# EAGLE design tick-ref-gps-disp (EAGLE 6.2)
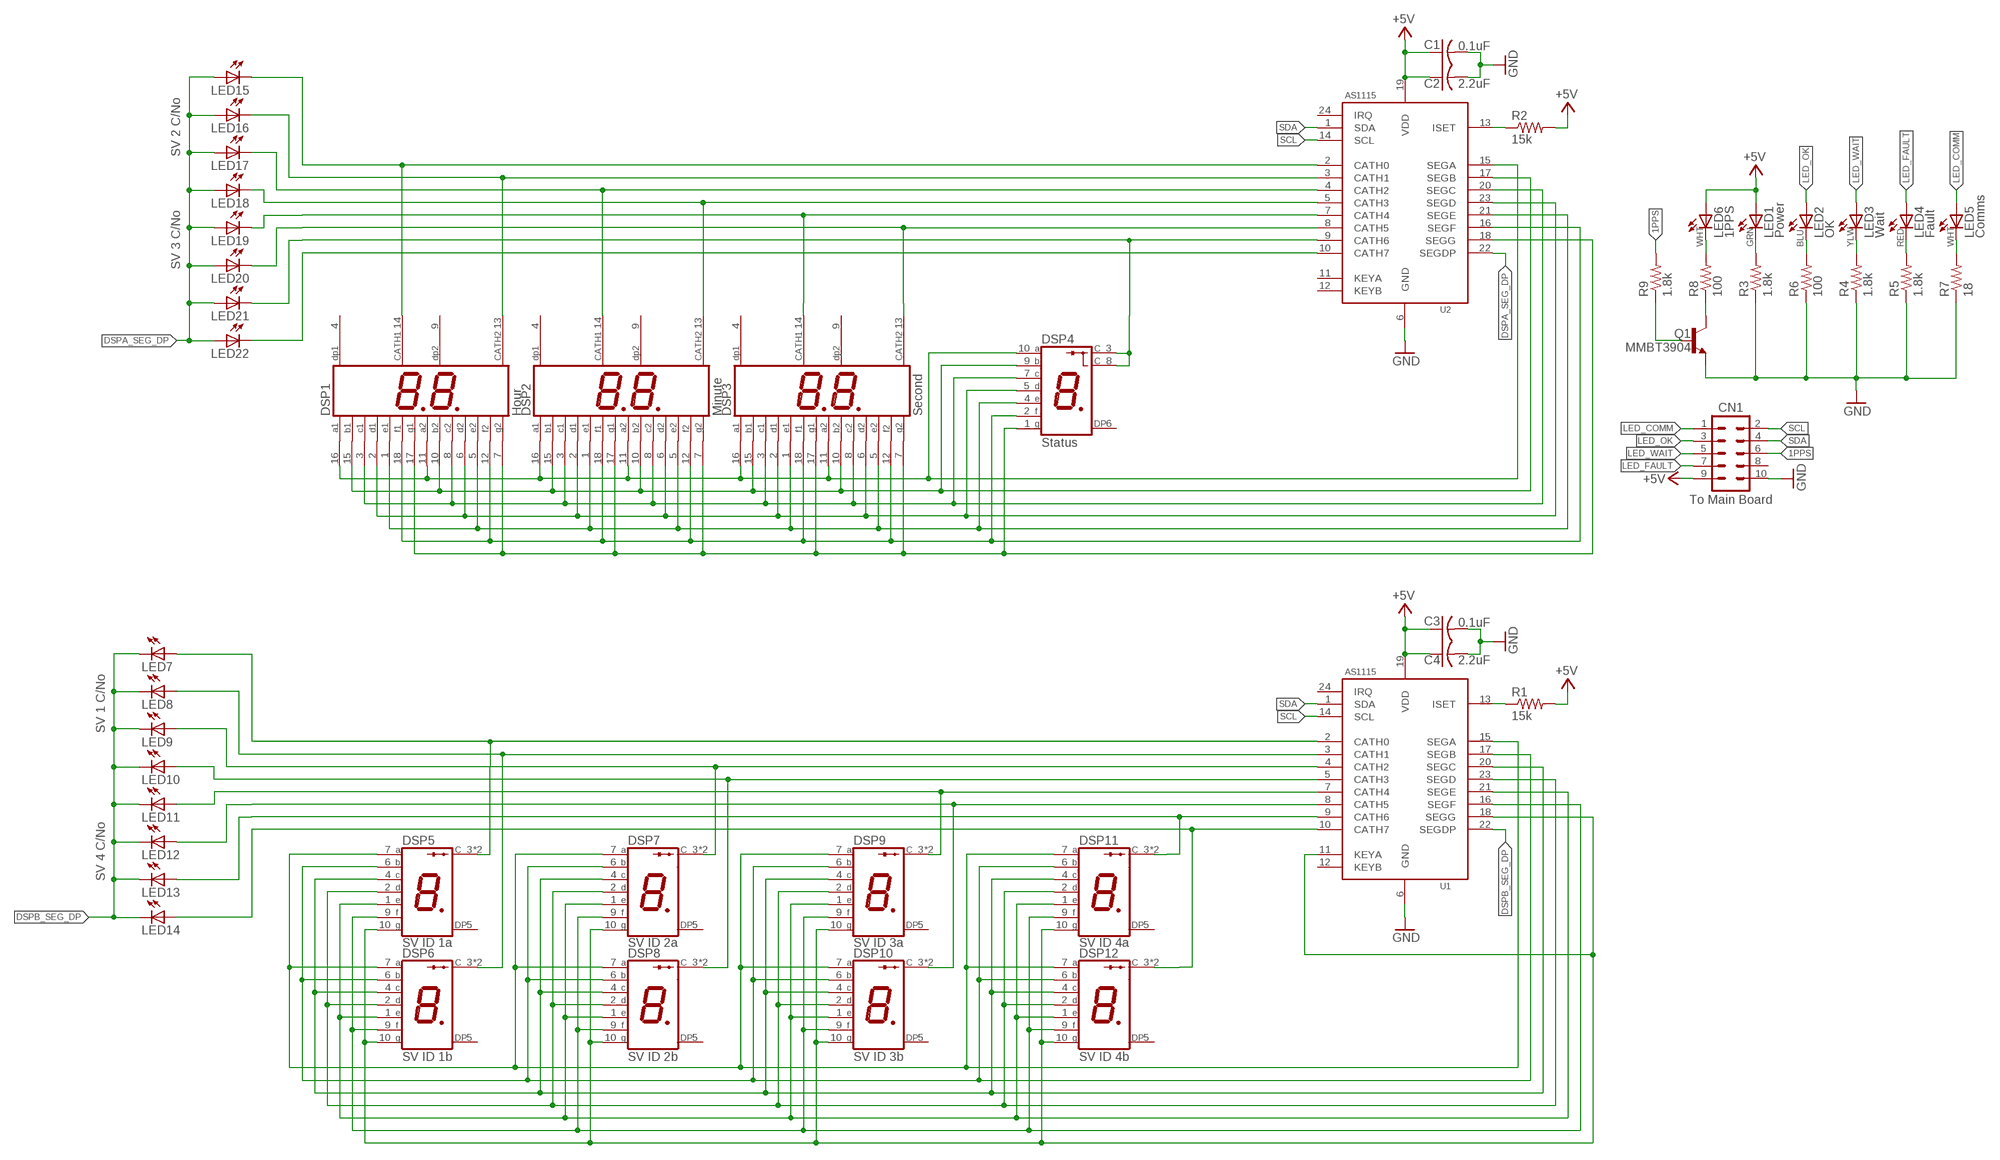
[diagram p0: schematic, sheet 1]

## Parts
C1  0.1uF  C-USC0603  [C0603]
C2  2.2uF  C-USC0805  [C0805]
C3  0.1uF  C-USC0603  [C0603]
C4  2.2uF  C-USC0805  [C0805]
CN1  To Main Board  M05X2PTH  [AVR_ICSP]
DSP1  Hour  LUMEX-LDD-C81XRI  [LUMEX-LDD-C81XRI]
DSP2  Minute  LUMEX-LDD-C81XRI  [LUMEX-LDD-C81XRI]
DSP3  Second  LUMEX-LDD-C81XRI  [LUMEX-LDD-C81XRI]
DSP4  Status  S4301B  [S4301B]
DSP5  SV ID 1a  KINGBRIGHT-ACSC02  [KINGBRIGHT-ACSA02]
DSP6  SV ID 1b  KINGBRIGHT-ACSC02  [KINGBRIGHT-ACSA02]
DSP7  SV ID 2a  KINGBRIGHT-ACSC02  [KINGBRIGHT-ACSA02]
DSP8  SV ID 2b  KINGBRIGHT-ACSC02  [KINGBRIGHT-ACSA02]
DSP9  SV ID 3a  KINGBRIGHT-ACSC02  [KINGBRIGHT-ACSA02]
DSP10  SV ID 3b  KINGBRIGHT-ACSC02  [KINGBRIGHT-ACSA02]
DSP11  SV ID 4a  KINGBRIGHT-ACSC02  [KINGBRIGHT-ACSA02]
DSP12  SV ID 4b  KINGBRIGHT-ACSC02  [KINGBRIGHT-ACSA02]
LED1  Power  LED5MM  [LED5MM]
LED2  OK  LED5MM  [LED5MM]
LED3  Wait  LED5MM  [LED5MM]
LED4  Fault  LED5MM  [LED5MM]
LED5  Comms  LED5MM  [LED5MM]
LED6  1PPS  LED5MM  [LED5MM]
LED7  LEDCHIP-LED0805  [CHIP-LED0805]
LED8  LEDCHIP-LED0805  [CHIP-LED0805]
LED9  LEDCHIP-LED0805  [CHIP-LED0805]
LED10  LEDCHIP-LED0805  [CHIP-LED0805]
LED11  LEDCHIP-LED0805  [CHIP-LED0805]
LED12  LEDCHIP-LED0805  [CHIP-LED0805]
LED13  LEDCHIP-LED0805  [CHIP-LED0805]
LED14  LEDCHIP-LED0805  [CHIP-LED0805]
LED15  LEDCHIP-LED0805  [CHIP-LED0805]
LED16  LEDCHIP-LED0805  [CHIP-LED0805]
LED17  LEDCHIP-LED0805  [CHIP-LED0805]
LED18  LEDCHIP-LED0805  [CHIP-LED0805]
LED19  LEDCHIP-LED0805  [CHIP-LED0805]
LED20  LEDCHIP-LED0805  [CHIP-LED0805]
LED21  LEDCHIP-LED0805  [CHIP-LED0805]
LED22  LEDCHIP-LED0805  [CHIP-LED0805]
Q1  MMBT3904  TRANSISTOR_NPNSOT23  [SOT23]
R1  15k  R-US_R0603  [R0603]
R2  15k  R-US_R0603  [R0603]
R3  1.8k  R-US_R0603  [R0603]
R4  1.8k  R-US_R0603  [R0603]
R5  1.8k  R-US_R0603  [R0603]
R6  100  R-US_R0603  [R0603]
R7  18  R-US_R0603  [R0603]
R8  100  R-US_R0603  [R0603]
R9  1.8k  R-US_R0603  [R0603]
U1  AS1115  [QSOP24]
U2  AS1115  [QSOP24]

## Nets
1PPS: CN1.6 R9.2
1PPS_Q: Q1.1(B) R9.1
1PPS_R_Q: Q1.3(C) R8.1
+5V: C1.1 C2.1 C3.1 C4.1 CN1.9 LED1.A LED6.A R1.2 R2.2 U1.19(VDD) U2.19(VDD)
CATH_HOUR_LS: DSP1.13(CATH2) LED16.C U2.3(CATH1)
CATH_HOUR_MS: DSP1.14(CATH1) LED15.C U2.2(CATH0)
CATH_MIN_LS: DSP2.13(CATH2) LED18.C U2.5(CATH3)
CATH_MIN_MS: DSP2.14(CATH1) LED17.C U2.4(CATH2)
CATH_SEC_LS: DSP3.13(CATH2) LED20.C U2.8(CATH5)
CATH_SEC_MS: DSP3.14(CATH1) LED19.C U2.7(CATH4)
CATH_STATUS_MS: DSP4.3(C) DSP4.8(C) LED21.C U2.9(CATH6)
CATH_STRENGTH: LED22.C U2.10(CATH7)
DSP5-C: DSP5.3(CATH) DSP5.8(CATH) LED7.A U1.2(CATH0)
DSP6-C: DSP6.3(CATH) DSP6.8(CATH) LED8.A U1.3(CATH1)
DSP7-C: DSP7.3(CATH) DSP7.8(CATH) LED9.A U1.4(CATH2)
DSP8-C: DSP8.3(CATH) DSP8.8(CATH) LED10.A U1.5(CATH3)
DSP9-C: DSP9.3(CATH) DSP9.8(CATH) LED11.A U1.7(CATH4)
DSP10-C: DSP10.3(CATH) DSP10.8(CATH) LED12.A U1.8(CATH5)
DSP11-C: DSP11.3(CATH) DSP11.8(CATH) LED13.A U1.9(CATH6)
DSP12-C: DSP12.3(CATH) DSP12.8(CATH) LED14.A U1.10(CATH7)
DSPA_SEG_A: DSP1.11(A2) DSP1.16(A1) DSP2.11(A2) DSP2.16(A1) DSP3.11(A2) DSP3.16(A1) DSP4.10(A) U2.15(SEGA)
DSPA_SEG_B: DSP1.10(B2) DSP1.15(B1) DSP2.10(B2) DSP2.15(B1) DSP3.10(B2) DSP3.15(B1) DSP4.9(B) U2.17(SEGB)
DSPA_SEG_C: DSP1.3(C1) DSP1.8(C2) DSP2.3(C1) DSP2.8(C2) DSP3.3(C1) DSP3.8(C2) DSP4.7(C) U2.20(SEGC)
DSPA_SEG_D: DSP1.2(D1) DSP1.6(D2) DSP2.2(D1) DSP2.6(D2) DSP3.2(D1) DSP3.6(D2) DSP4.5(D) U2.23(SEGD)
DSPA_SEG_DP: LED15.A LED16.A LED17.A LED18.A LED19.A LED20.A LED21.A LED22.A U2.22(SEGDP)
DSPA_SEG_E: DSP1.1(E1) DSP1.5(E2) DSP2.1(E1) DSP2.5(E2) DSP3.1(E1) DSP3.5(E2) DSP4.4(E) U2.21(SEGE)
DSPA_SEG_F: DSP1.12(F2) DSP1.18(F1) DSP2.12(F2) DSP2.18(F1) DSP3.12(F2) DSP3.18(F1) DSP4.2(F) U2.16(SEGF)
DSPA_SEG_G: DSP1.7(G2) DSP1.17(G1) DSP2.7(G2) DSP2.17(G1) DSP3.7(G2) DSP3.17(G1) DSP4.1(G) U2.18(SEGG)
DSPB_SEG_A: DSP5.7(A) DSP6.7(A) DSP7.7(A) DSP8.7(A) DSP9.7(A) DSP10.7(A) DSP11.7(A) DSP12.7(A) U1.15(SEGA)
DSPB_SEG_B: DSP5.6(B) DSP6.6(B) DSP7.6(B) DSP8.6(B) DSP9.6(B) DSP10.6(B) DSP11.6(B) DSP12.6(B) U1.17(SEGB)
DSPB_SEG_C: DSP5.4(C) DSP6.4(C) DSP7.4(C) DSP8.4(C) DSP9.4(C) DSP10.4(C) DSP11.4(C) DSP12.4(C) U1.20(SEGC)
DSPB_SEG_D: DSP5.2(D) DSP6.2(D) DSP7.2(D) DSP8.2(D) DSP9.2(D) DSP10.2(D) DSP11.2(D) DSP12.2(D) U1.23(SEGD)
DSPB_SEG_DP: LED7.C LED8.C LED9.C LED10.C LED11.C LED12.C LED13.C LED14.C U1.22(SEGDP)
DSPB_SEG_E: DSP5.1(E) DSP6.1(E) DSP7.1(E) DSP8.1(E) DSP9.1(E) DSP10.1(E) DSP11.1(E) DSP12.1(E) U1.21(SEGE)
DSPB_SEG_F: DSP5.9(F) DSP6.9(F) DSP7.9(F) DSP8.9(F) DSP9.9(F) DSP10.9(F) DSP11.9(F) DSP12.9(F) U1.16(SEGF)
DSPB_SEG_G: DSP5.10(G) DSP6.10(G) DSP7.10(G) DSP8.10(G) DSP9.10(G) DSP10.10(G) DSP11.10(G) DSP12.10(G) U1.11(KEYA) U1.18(SEGG)
GND: C1.2 C2.2 C3.2 C4.2 CN1.10 Q1.2(E) R3.1 R4.1 R5.1 R6.1 R7.1 U1.6(GND) U2.6(GND)
LED1_R: LED1.K(C) R3.2
LED2_R: LED2.K(C) R6.2
LED3_R: LED3.K(C) R4.2
LED4_R: LED4.K(C) R5.2
LED5_R: LED5.K(C) R7.2
LED6_R: LED6.K(C) R8.2
LED_COMM: CN1.1 LED5.A
LED_FAULT: CN1.7 LED4.A
LED_ISET: R2.1 U2.13(ISET)
LED_ISET1: R1.1 U1.13(ISET)
LED_OK: CN1.3 LED2.A
LED_WAIT: CN1.5 LED3.A
SCL: CN1.2 U1.14(SCL) U2.14(SCL)
SDA: CN1.4 U1.1(SDA) U2.1(SDA)
Unconnected: CN1.8 DSP1.4(DP1) DSP1.9(DP2) DSP2.4(DP1) DSP2.9(DP2) DSP3.4(DP1) DSP3.9(DP2) DSP4.6(DP) DSP5.5(DP) DSP6.5(DP) DSP7.5(DP) DSP8.5(DP) DSP9.5(DP) DSP10.5(DP) DSP11.5(DP) DSP12.5(DP) U1.12(KEYB) U1.24(IRQ) U2.11(KEYA) U2.12(KEYB) U2.24(IRQ)

## Notes on the sheet
- SV 2 C/No
- SV 3 C/No
- WHT | GRN | BLU | YLW | RED | WHT
- SV 1 C/No
- SV 4 C/No

## Library data of the parts
C1-C4 = rcl:C-US: CAPACITOR, American symbol
CN1 = SparkFun-Connectors:M05X2: Header 5x2 Standard 10-pin dual row 0.1" header. Commonly used with AVR-ISP. Use with Spark Fun Electronics SKU: PRT-00778
DSP1-DSP3 = led-sen:LUMEX-LDD-C81XRI: LED DISPLAY 2 x 1 character 7 segment, decimal points right, 0.80" high digits; OC_FARNELL: unknown; OC_NEWARK: unknown
DSP4 = led-7-segment:S4301B: Single Digit Seven-Segment Display (cathode common) Source: LITEON .. S4301B.pdf
DSP5-DSP12 = led-sen:KINGBRIGHT-ACSC02: 5mm high common-cathode 7-segment SMD LED display with decimal point
LED1-LED22 = led:LED: LED OSRAM: - CHIPLED LG R971, LG N971, LY N971, LG Q971, LY Q971, LO R971, LY R971 LH N974, LH R974 LS Q976, LO Q976, LY Q976 LO Q996 - Hyper CHIPLED LW Q18S LB Q993, LB Q99A, LB R99A - SideLED LS A670, LO A670, LY A670, LG A670, LP A670 LB A673, LV A673, LT A673, LW A673 LH A674 LY A675 LS A676, LA A676, LO A676, LY A676, LW A676 LS A679, LY A679, LG A679 - Hyper Micro SIDELED® LS Y876, LA Y876, LO Y876, LY Y876 LT Y87S - SmartLED LW L88C, LW L88S LB L89C, LB L89S, LG L890 LS L89K, LO L89K, LY L89K LS L896, LA L896, LO L896, LY L896 - TOPLED LS T670, LO T670, LY T670, LG T670, LP T670 LSG T670, LSP T670, LSY T670, LOP T670, LYG T670 LG T671, LOG T671, LSG T671 LB T673, LV T673, LT T673, LW T673 LH T674 LS T676, LA T676, LO T676, LY T676, LB T676, LH T676, LSB T676, LW T676 LB T67C, LV T67C, LT T67C, LS T67K, LO T67K, LY T67K, LW E67C LS E67B, LA E67B, LO E67B, LY E67B, LB E67C, LV E67C, LT E67C LW T67C LS T679, LY T679, LG T679 LS T770, LO T770, LY T770, LG T770, LP T770 LB T773, LV T773, LT T773, LW T773 LH T774 LS E675, LA E675, LY E675, LS T675 LS T776, LA T776, LO T776, LY T776, LB T776 LHGB T686 LT T68C, LB T68C - Hyper Mini TOPLED® LB M676 - Mini TOPLED Santana® LG M470 LS M47K, LO M47K, LY M47K Source: http://www.osram.convergy.de LUXEON: - LUMILED® LXK2-PW12-R00, LXK2-PW12-S00, LXK2-PW14-U00, LXK2-PW14-V00 LXK2-PM12-R00, LXK2-PM12-S00, LXK2-PM14-U00 LXK2-PE12-Q00, LXK2-PE12-R00, LXK2-PE12-S00, LXK2-PE14-T00, LXK2-PE14-U00 LXK2-PB12-K00, LXK2-PB12-L00, LXK2-PB12-M00, LXK2-PB14-N00, LXK2-PB14-P00, LXK2-PB14-Q00 LXK2-PR12-L00, LXK2-PR12-M00, LXK2-PR14-Q00, LXK2-PR14-R00 LXK2-PD12-Q00, LXK2-PD12-R00, LXK2-PD12-S00 LXK2-PH12-R00, LXK2-PH12-S00 LXK2-PL12-P00, LXK2-PL12-Q00, LXK2-PL12-R00 Source: www.luxeon.com KINGBRIGHT: KA-3528ASYC Source: www.kingbright.com
Q1 = SparkFun:TRANSISTOR_NPN: Transistor NPN BJT configuration in SOT23 package. MMBT2222 is the common NPN we use. Double check BCE configuration again layout.
R1-R9 = rcl:R-US_: RESISTOR, American symbol
U1 U2 = austria-sen:AS1115: austriamicrosystems AS1115 64-channel I2C LED driver. Drives 8x8 matrix or 8x 7-segment displays

## Board
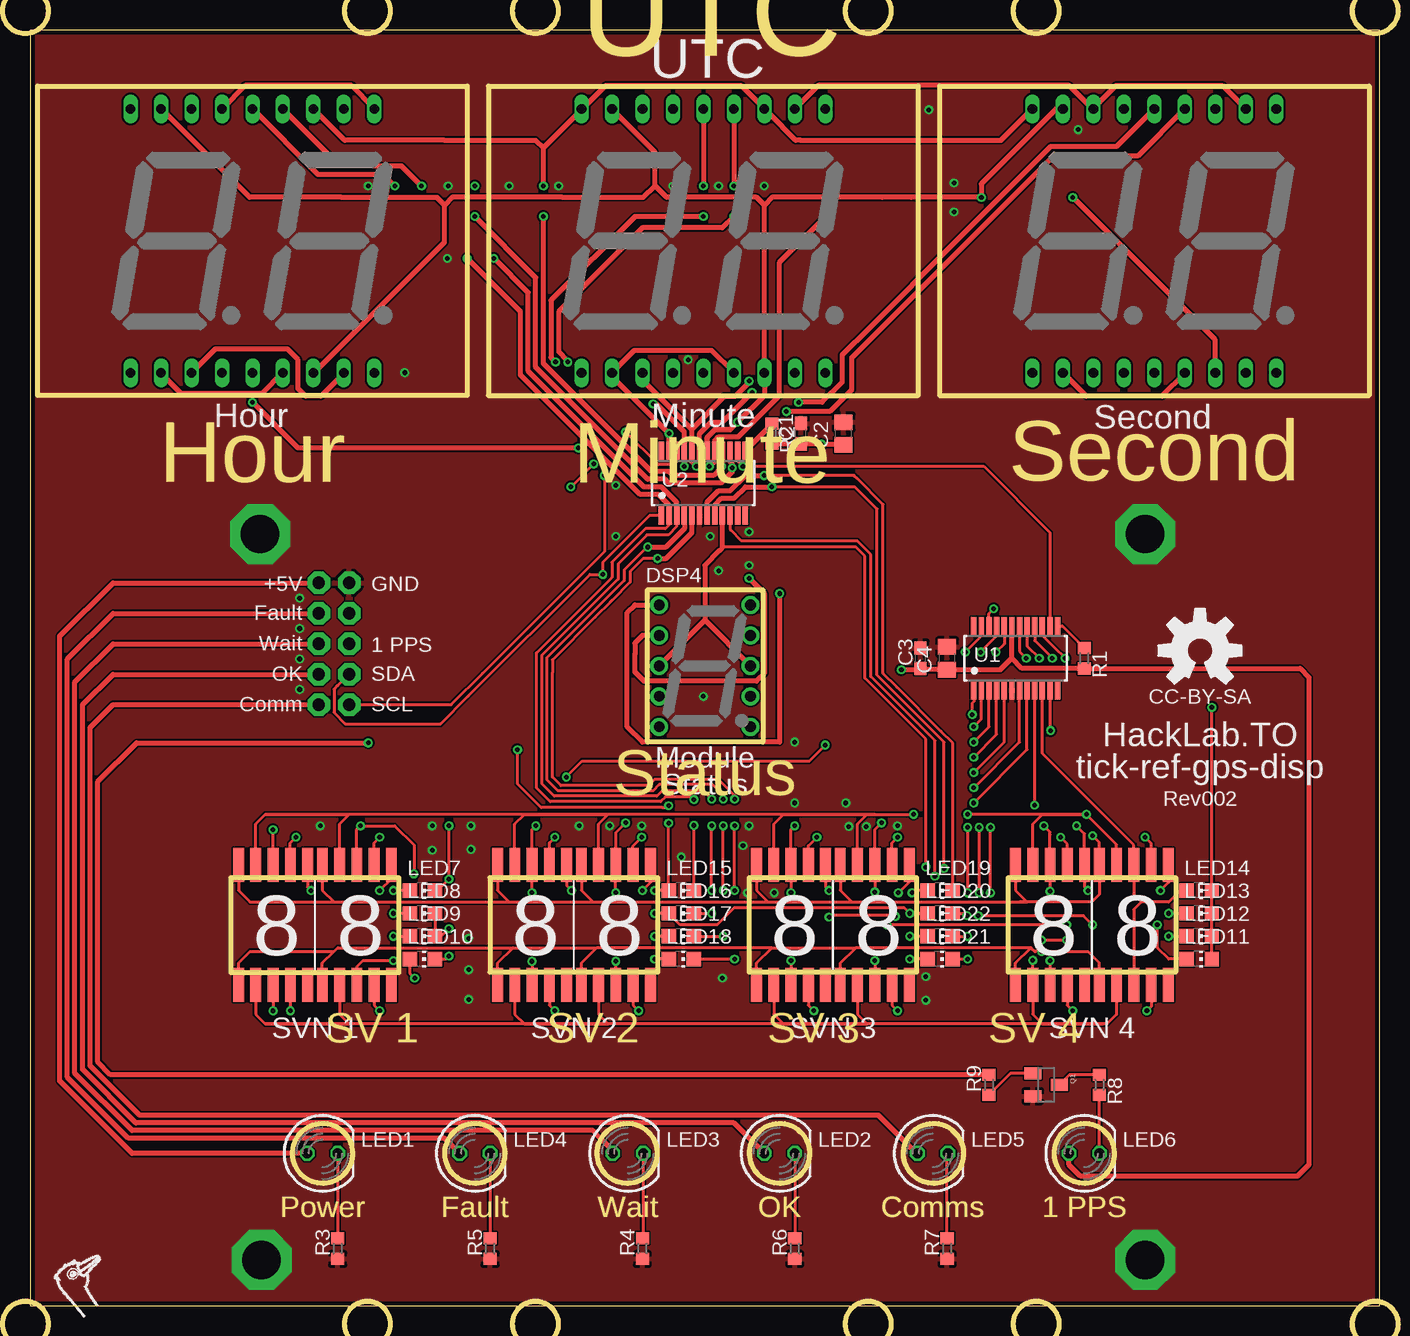
[diagram p1: board, top side]
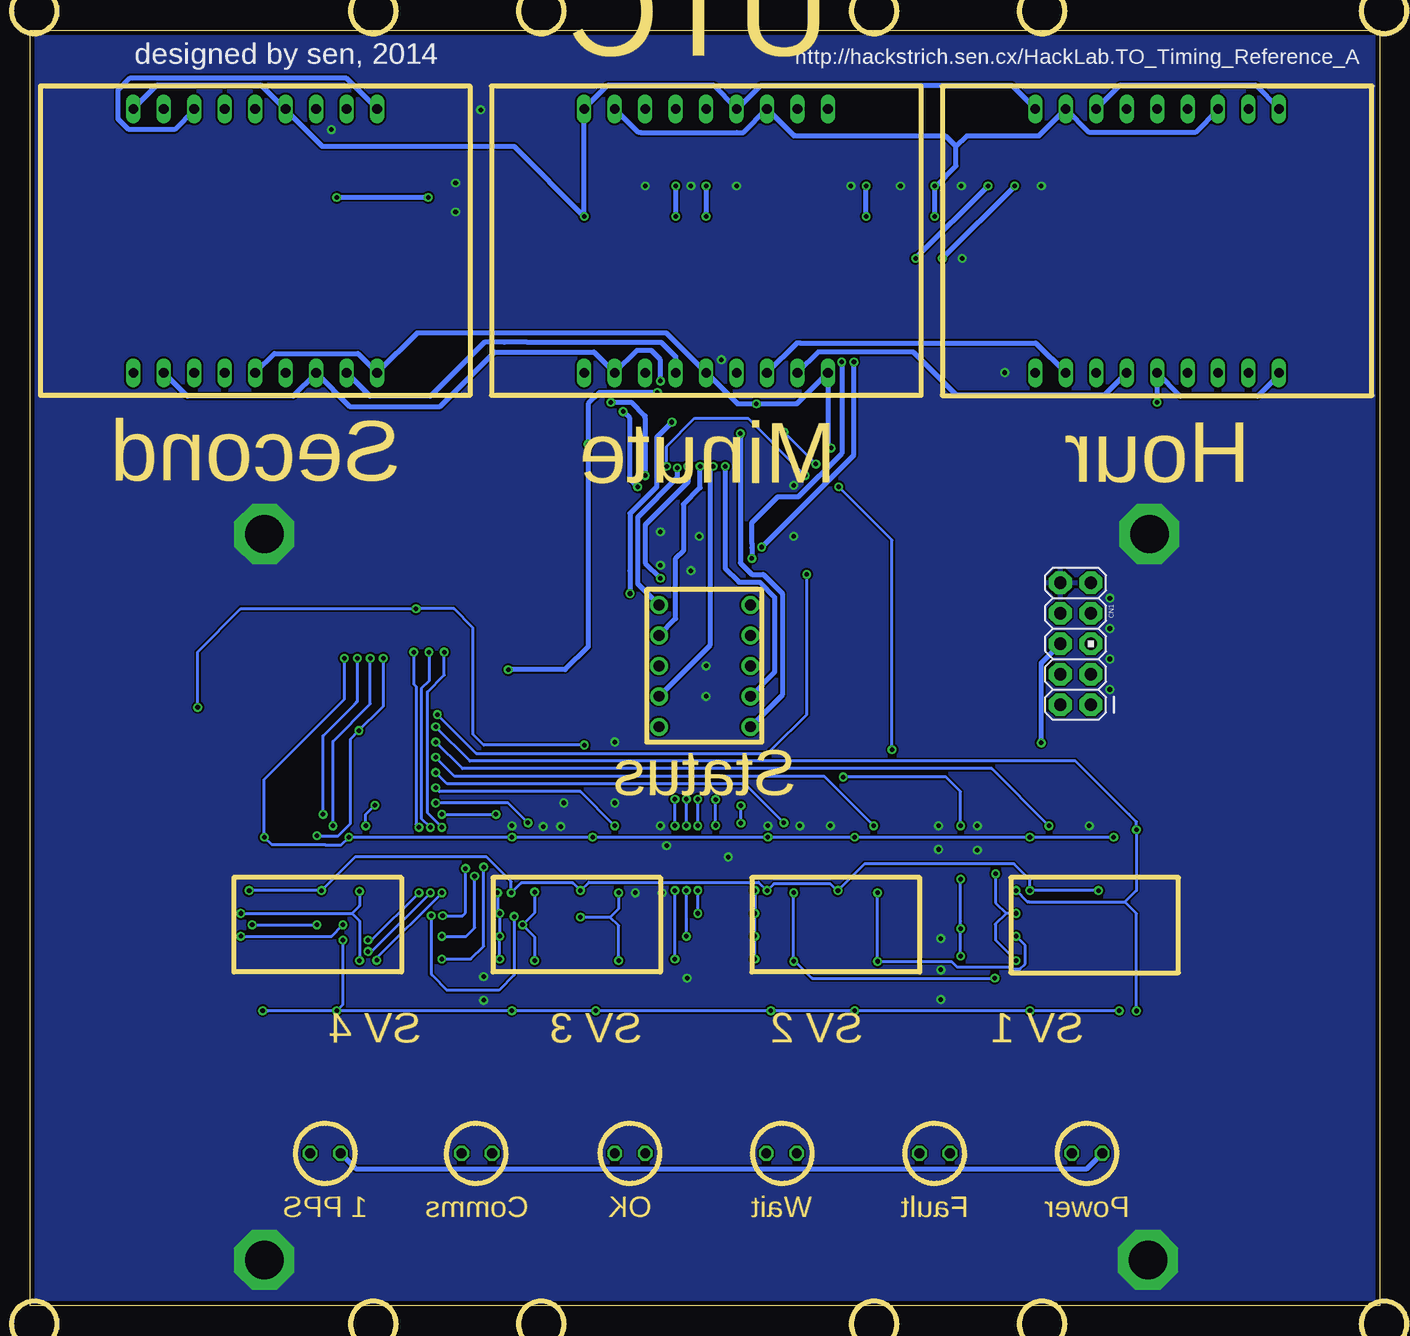
[diagram p2: board, bottom side, seen from below]

Size 112.5 x 106.35 mm. Coordinates in mm from the lower left corner, seen from the top.
Outline: 0,0 112.5,0 112.5,106.35 0,106.35 0,0
Copper layers (1*16): Top 0.0356mm / dielectric 1.5011mm / Bottom 0.0356mm
Design rules: minimum track width 6mil, minimum drill 13mil, track to track 6mil, track to pad 6mil, pad to pad 6mil, via to via 6mil, smd to smd 6mil, copper to edge 15mil, drill to drill 6mil, minimum pad ring 7mil, minimum via ring 7mil, stop-mask expansion 4mil, vias tented up to drill 25mil, thermal gap 10mil
Milling: 80 lines

### Footprints (pad centres in the part's own frame; a part is rotated, then mirrored left to right if it is on the bottom)
C0603 = smd 1.1 x 1: 1 -0.85,0; 2 0.85,0
C0805 = smd 1.3 x 1.5: 1 -0.95,0; 2 0.95,0
AVR_ICSP = drill 1.016 pad 1.88 octagon: 1 -1.27,5.08; 2 1.27,5.08; 3 -1.27,2.54; 4 1.27,2.54; 5 -1.27,0; 6 1.27,0; 7 -1.27,-2.54; 8 1.27,-2.54; 9 -1.27,-5.08; 10 1.27,-5.08
LUMEX-LDD-C81XRI = drill 0.813 long: 1 -10.16,-10.998; 2 -7.62,-10.998; 3 -5.08,-10.998; 4 -2.54,-10.998; 5 0,-10.998; 6 2.54,-10.998; 7 5.08,-10.998; 8 7.62,-10.998; 9 10.16,-10.998; 10 10.16,10.998; 11 7.62,10.998; 12 5.08,10.998; 13 2.54,10.998; 14 0,10.998; 15 -2.54,10.998; 16 -5.08,10.998; 17 -7.62,10.998; 18 -10.16,10.998
S4301B = drill 0.9 pad 1.5: 1 -3.81,5.08; 2 -3.81,2.54; 3 -3.81,0; 4 -3.81,-2.54; 5 -3.81,-5.08; 6 3.81,-5.08; 7 3.81,-2.54; 8 3.81,0; 9 3.81,2.54; 10 3.81,5.08
KINGBRIGHT-ACSA02 = smd 0.9 x 2.8: 1 -3,-5; 2 -1.56,-5; 3 -0.12,-5; 4 1.32,-5; 5 2.76,-5; 6 2.76,5; 7 1.32,5; 8 -0.12,5; 9 -1.56,5; 10 -3,5
LED5MM = drill 0.813 octagon: A -1.27,0; K 1.27,0
CHIP-LED0805 = smd 1.2 x 1.2: A 0,-1.05; C 0,1.05
SOT23 = smd 1 x 1.4: 1 -0.95,-1.1; 2 0.95,-1.1; 3 0,1.1
R0603 = smd 1 x 1.1: 1 -0.85,0; 2 0.85,0
QSOP24 = smd 0.45 x 1.5: 1 -3.493,-2.69; 2 -2.857,-2.69; 3 -2.223,-2.69; 4 -1.587,-2.69; 5 -0.953,-2.69; 6 -0.318,-2.69; 7 0.318,-2.69; 8 0.953,-2.69; 9 1.587,-2.69; 10 2.223,-2.69; 11 2.857,-2.69; 12 3.493,-2.69; 13 3.493,2.69; 14 2.857,2.69; 15 2.223,2.69; 16 1.587,2.69; 17 0.953,2.69; 18 0.318,2.69; 19 -0.318,2.69; 20 -0.953,2.69; 21 -1.587,2.69; 22 -2.223,2.69; 23 -2.857,2.69; 24 -3.493,2.69

### Placement (x,y rotation side)
C1  64.26,72.71 90 top
C2  67.82,72.71 90 top
C3  74.23,53.98 90 top
C4  76.45,53.98 90 top
CN1  25.34,55.18 180 bottom
DSP1  18.54,88.77 0 top
DSP2  56.13,88.77 0 top
DSP3  93.73,88.77 0 top
DSP4  56.26,53.34 0 top
DSP5  20.38,31.75 0 top
DSP6  27.37,31.75 0 top
DSP7  41.97,31.75 0 top
DSP8  48.96,31.75 0 top
DSP9  63.56,31.75 0 top
DSP10  70.55,31.75 0 top
DSP11  85.15,31.75 0 top
DSP12  92.14,31.75 0 top
LED1  24.38,12.7 0 top
LED2  62.48,12.7 0 top
LED3  49.85,12.7 0 top
LED4  37.08,12.7 0 top
LED5  75.25,12.7 0 top
LED6  87.88,12.7 0 top
LED7  32.7,34.61 270 top
LED8  32.7,32.7 270 top
LED9  32.7,30.8 270 top
LED10  32.7,28.89 270 top
LED11  97.47,28.89 270 top
LED12  97.47,30.8 270 top
LED13  97.47,32.7 270 top
LED14  97.47,34.61 270 top
LED15  54.29,34.61 270 top
LED16  54.29,32.7 270 top
LED17  54.29,30.8 270 top
LED18  54.29,28.89 270 top
LED19  75.88,34.61 270 top
LED20  75.88,32.7 270 top
LED21  75.88,28.89 270 top
LED22  75.88,30.8 270 top
Q1  84.71,18.41 270 top
R1  87.88,53.98 270 top
R2  61.85,72.71 270 top
R3  25.65,4.76 90 top
R4  51.05,4.76 90 top
R5  38.35,4.76 90 top
R6  63.75,4.76 90 top
R7  76.45,4.76 90 top
R8  89.15,18.41 270 top
R9  79.95,18.41 90 top
U1  82.17,53.98 0 top
U2  56.13,68.58 0 top
U$1  [OSHW-LOGO-L]  97.54,54.61 0 top
U$2  [STRICH-LOGO-R]  3.75,1.08 40 top

### Tracks (layer width: path | path; a pad name or v marks a point on that pad's centre or on a via)
1PPS  (via drill 0.38)
  Top 0.406: R9.2 6.71,19.27 5.65,20.32 5.65,43.69 8.89,46.93 v28.19,46.93
  Bottom 0.406: v28.19,46.93 28.19,53.59 CN1.6
1PPS_Q
  Top 0.254: Q1.1 81.75,19.36 R9.1
1PPS_R_Q
  Top 0.254: R8.1 86.66,19.27 Q1.3
+5V  (via drill 0.38)
  Top 0.406: v60.2,76.14 59.94,75.88 58.36,74.3 57.72,73.66 56.77,73.66 55.82,72.71 U2.19 | LED1.A 8.51,12.7 2.48,18.73 2.48,53.28 2.48,55.82 6.92,60.26 CN1.9 | LED6.A 86.61,11.75 87.57,10.79 105.66,10.79 106.62,11.75 106.62,52.39 105.88,53.12 R1.2 82.7,53.12 81.85,53.98 | 81.85,53.98 U1.19 | 81.85,53.98 80.9,53.02 C4.1 74.33,53.02 C3.1 74.23,53.02 v72.64,53.02 | R2.2 C1.1 | C1.1 65.94,71.86 | 65.94,71.86 v65.98,71.82 | C1.1 65.94,71.86 | 65.94,71.86 v65.98,71.82 | v65.98,71.82 67.76,71.82 C2.1
  Bottom 0.406: v60.2,76.14 65.02,76.14 65.98,75.18 v65.98,71.82 65.98,54.93 67.88,53.02 v72.64,53.02 | LED6.A 85.66,11.75 85.34,11.43 24.38,11.43 LED1.A
CATH_HOUR_LS  (via drill 0.38)
  Top 0.254: LED16.C v56.83,32.7 | v56.83,34.61 v56.83,40.01 | v56.83,42.23 56.13,42.93 52.7,42.93 52.26,42.48 43.69,42.48 42.67,43.5 42.67,52.77 42.67,54.23 48.13,59.69 49.02,60.58 49.02,61.85 51.44,64.26 53.21,64.26 53.91,64.96 U2.3
  Top 0.406: U2.3 53.91,66.99 52.64,68.26 51.18,68.26 41.53,77.92 41.53,84.45 v38.67,87.31 | v32.64,93.34 30.99,95 25.86,95 DSP1.13
  Bottom 0.254: v56.83,32.7 v56.83,34.61 | v56.83,40.01 v56.83,42.23
  Bottom 0.406: v32.64,93.34 v38.67,87.31
CATH_HOUR_MS  (via drill 0.38)
  Top 0.254: LED15.C v55.34,40.03 | v55.34,42.19 55.12,42.42 52.96,42.42 52.58,42.04 43.37,42.04 42.23,43.18 42.23,54.42 48.51,60.71 48.51,61.98 51.31,64.77 52.96,64.77 53.28,65.09 U2.2
  Top 0.406: U2.2 53.28,66.74 52.39,67.63 50.86,67.63 40.89,77.6 40.89,82.87 v36.45,87.31 | v30.42,93.34 29.46,94.3 24.02,94.3 DSP1.14
  Bottom 0.254: v55.34,40.03 v55.34,42.19
  Bottom 0.406: v30.42,93.34 v36.45,87.31
CATH_MIN_LS  (via drill 0.38)
  Top 0.254: LED18.C v58.74,28.89 | v58.74,34.61 v58.74,40.01 | v58.74,42.23 58.74,42.55 57.4,43.88 52.07,43.88 51.56,43.37 44.26,43.37 43.56,44.07 43.56,52.77 43.56,53.85 47.12,57.4 48.39,58.67 48.51,58.8 50.04,60.33 50.04,61.21 51.12,62.29 v52.32,62.29
  Top 0.406: DSP2.13 v58.67,93.34 | v58.67,90.81 57.72,89.85 51.05,89.85 44.07,82.87 44.07,79.57 44.83,78.8 v44.83,78.68 | v52.32,62.29 53.02,62.29 55.18,64.45 U2.5
  Bottom 0.254: v58.74,28.89 v58.74,34.61 | v58.74,40.01 v58.74,42.23
  Bottom 0.406: v58.67,93.34 v58.67,90.81 | v44.83,78.68 44.83,71.06 48.45,67.44 50.16,67.44 52.32,65.28 52.32,63.56 52.32,63.18 v52.32,62.29
CATH_MIN_MS  (via drill 0.38)
  Top 0.254: LED17.C v57.78,30.8 | v57.78,34.61 v57.78,40.01 | v57.78,42.23 57.78,42.55 56.9,43.43 52.45,43.43 51.94,42.93 44.01,42.93 43.12,43.81 43.12,54.04 49.53,60.45 49.53,61.34 51.44,63.25 v51.5,63.25
  Top 0.406: DSP2.14 v56.13,93.34 | v56.13,90.81 50.42,90.81 43.43,83.82 43.43,79.06 v43.81,78.68 | U2.4 54.55,64.77 53.02,63.25 v51.5,63.25
  Bottom 0.254: v57.78,30.8 v57.78,34.61 | v57.78,40.01 v57.78,42.23
  Bottom 0.406: v56.13,93.34 v56.13,90.81 | v43.81,78.68 43.81,70.93 v51.5,63.25
CATH_SEC_LS  (via drill 0.38)
  Top 0.254: LED20.C 77.92,32.7 v78.11,32.51 | v76.2,36.45 76.2,46.99 70.61,52.58 70.61,66.42 68.77,68.26 v61.85,68.26
  Top 0.406: U2.8 57.09,66.74 57.66,67.31 58.67,67.31 59.63,68.26 v61.85,68.26 | DSP3.13 92.38,95.89 85.34,95.89 68.52,79.06 68.52,76.39 66.67,74.55 v63.06,74.55
  Bottom 0.254: v78.11,32.51 76.45,32.51 76.2,32.77 v76.2,36.45
  Bottom 0.406: v61.85,68.26 62.48,68.9 62.48,73.98 v63.06,74.55
CATH_SEC_MS  (via drill 0.38)
  Top 0.254: LED19.C 76.93,46.89 75.95,47.88 72.26,51.56 71.12,52.7 71.12,66.8 68.96,68.96 68.71,69.22 v61.21,69.22
  Top 0.406: U2.7 56.45,66.99 57.4,67.94 58.36,67.94 59.63,69.22 60.9,69.22 v61.21,69.22 | DSP3.14 90.6,96.65 85.09,96.65 78.3,89.85 78.17,89.72 68.83,80.39 68.77,80.33 67.69,79.25 67.69,76.96 66.04,75.31 v64.07,75.31
  Bottom 0.406: v64.07,75.31 62.36,75.31 61.21,74.17 61.21,73.98 v61.21,69.22
CATH_STATUS_MS  (via drill 0.38)
  Top 0.254: LED21.C v78.17,28.89 | v74.68,36.58 74.68,47.24 69.6,52.32 69.6,62.48 68.83,63.25 57.78,63.25 57.53,62.99
  Top 0.406: U2.9 57.72,63.18 57.53,62.99 56.26,61.72 56.26,57.15 | 56.26,57.15 DSP4.8 | 56.26,57.15 DSP4.3
  Bottom 0.254: v78.17,28.89 75.75,28.89 74.68,29.97 v74.68,36.58
CATH_STRENGTH  (via drill 0.38)
  Top 0.254: LED22.C v78.17,30.8 | v75.44,35.81 75.44,47.12 70.23,52.32 70.1,52.45 70.1,62.61 68.96,63.75 59.31,63.75 58.42,64.64 58.36,64.71 U2.10
  Bottom 0.254: v78.17,30.8 76.14,30.8 75.44,31.5 v75.44,35.81
DSP5-C  (via drill 0.38)
  Top 0.254: DSP5.3 v20.26,24.58 | v78.68,48.26 79.31,48.9 U1.2 | DSP5.8 v20.26,39.69 | LED7.A 30.8,34.61 v30.29,34.61
  Bottom 0.254: v20.26,24.58 20.26,32.7 21.22,33.66 | v20.26,39.69 20.26,39.37 | 20.26,39.37 v20.26,39.69 | v20.26,39.69 20.26,40.33 20.89,40.96 25.34,45.4 75.82,45.4 v78.68,48.26 | v20.26,39.69 20.26,39.37 | 21.22,33.66 29.21,33.66 29.34,33.66 v30.29,34.61 | v20.26,39.69 20.26,34.61 21.22,33.66
DSP6-C  (via drill 0.38)
  Top 0.254: DSP6.8 27.25,39.69 v27.56,40.01 30.42,40.01 32,38.42 v32,36.01 | v78.68,46.99 79.95,48.26 U1.3 | v30.29,28.77 27.75,28.77 27.24,28.26 27.24,26.35 27.25,26.36 DSP6.3 | LED8.A v30.29,32.7
  Bottom 0.254: v27.56,40.01 32.32,44.77 76.45,44.77 v78.68,46.99 | v30.29,32.7 31.11,32.7 | v32,36.01 32,33.59 31.11,32.7 | 31.11,32.7 32,31.81 32,31.75 32,30.73 32,30.48 v30.29,28.77
DSP7-C  (via drill 0.38)
  Top 0.254: v42.16,40.01 41.85,39.69 DSP7.8 v41.85,34.42 | v78.68,45.72 80.58,47.62 U1.4 | v41.85,28.7 DSP7.3 | v30.29,30.8 LED9.A
  Bottom 0.254: v42.16,40.01 46.29,44.13 77.09,44.13 v78.68,45.72 | v41.85,34.42 v41.85,28.7 35.69,28.7 35.24,28.26 30.8,28.26 30.61,28.07 29.97,28.07 29.53,28.51 29.53,30.04 v30.29,30.8
DSP8-C  (via drill 0.38)
  Top 0.254: v49.66,40.26 48.84,39.44 DSP8.8 v48.83,34.42 | v78.68,44.45 81.22,46.99 U1.5 | DSP8.3 v48.84,28.71 | LED10.A 31.65,27.72 v32.07,27.3
  Bottom 0.254: v78.68,44.45 77.72,43.5 53.15,43.5 52.9,43.5 v49.66,40.26 | v48.83,34.42 v48.84,34.41 v48.84,28.71 48.71,28.71 47.31,27.3 v32.07,27.3
DSP9-C  (via drill 0.38)
  Top 0.254: v63.75,40.01 63.44,39.69 DSP9.8 v63.44,34.42 | v78.68,43.18 82.49,46.99 U1.7 | v63.44,28.77 DSP9.3 | v66.61,32.38 66.8,32.58 72.01,32.58 v72.14,32.45 | LED11.A 94.93,28.89 93.98,29.84 v93.98,31.75 | v88.58,31.75 87.82,32.51 v79.06,32.51
  Bottom 0.254: v63.75,40.01 66.61,42.86 78.36,42.86 v78.68,43.18 | v63.44,34.42 63.44,33.08 64.14,32.38 | v63.44,28.77 63.44,31.69 64.14,32.38 | 64.14,32.38 v66.61,32.38 | v93.98,31.75 v88.58,31.75 | v72.14,32.45 72.14,27.56 73.41,26.29 77.72,26.29 78.99,27.56 79.06,27.62 v79.06,32.51
DSP10-C  (via drill 0.38)
  Top 0.254: v70.99,40.26 70.43,39.69 DSP10.8 v70.43,34.49 | v78.68,41.91 83.12,46.35 U1.8 | v70.43,28.77 DSP10.3 | LED12.A v94.93,30.8 | v86.42,31.75 v71.44,31.75
  Bottom 0.254: v70.99,40.26 72.64,41.91 78.36,41.91 v78.68,41.91 | v70.43,28.77 70.43,30.73 70.43,30.74 v71.44,31.75 70.43,32.76 v70.43,34.49 | v94.93,30.8 87.38,30.8 v86.42,31.75
DSP11-C  (via drill 0.38)
  Top 0.254: v83.76,41.72 83.76,45.09 U1.9 | v85.03,34.55 DSP11.8 85.03,39.25 85.03,39.49 v84.52,40.01 | v85.03,28.77 DSP11.3 | LED13.A v94.93,32.7
  Bottom 0.254: v85.03,28.77 85.03,32.07 85.67,32.7 | v84.52,40.01 84.52,40.96 v83.76,41.72 | v94.93,32.7 85.67,32.7 | v85.03,34.55 85.03,33.34 85.67,32.7
DSP12-C
  Top 0.254: 90.42,40.01 90.23,40.2 | 90.23,40.2 84.39,46.04 U1.10 | DSP12.3 92.02,33.02 92.65,33.66 | 90.23,40.2 92.02,38.41 DSP12.8 92.02,34.29 92.65,33.66 | LED14.A 95.89,34.61 94.93,33.66 92.65,33.66
DSPA_SEG_A  (via drill 0.38)
  Top 0.406: 58.55,69.53 57.59,68.58 | 57.59,68.58 53.28,68.58 52.96,68.9 51.5,68.9 42.16,78.23 42.16,85.72 v37.08,90.81 | 57.59,68.58 58.55,69.53 | 58.55,69.53 v58.55,69.85 58.55,70.17 58.48,70.23 58.36,70.36 58.36,70.55 U2.15 | DSP3.11 99.39,101.73 90.55,101.73 88.65,99.82 DSP3.16 88.57,99.77 86.61,101.73 65.71,101.73 DSP2.11
  Bottom 0.406: v37.08,90.81 v37.08,93.34 36.96,93.34 35.31,95 35.31,96.65 | v58.55,69.85 58.55,69.03 61.85,65.72 61.85,61.28 61.85,60.2 DSP4.10 | DSP1.16 13.46,99.69 15.37,97.79 24.18,97.79 DSP1.11 26.58,99.35 28.4,97.54 28.45,97.54 34.42,97.54 35.31,96.65 | 35.31,96.65 36.2,97.54 48.64,97.54 48.82,97.54 DSP2.16 53.03,97.79 53.59,97.79 61.59,97.79 61.77,97.79 DSP2.11
DSPA_SEG_B  (via drill 0.38)
  Top 0.406: v66.29,90.81 62.48,87 62.48,75.88 59.05,72.45 57.4,72.45 57.09,72.14 U2.17 57.09,70.42 v56.64,69.98 | DSP1.10 28.7,99.82 26.8,101.73 17.96,101.73 DSP1.15
  Bottom 0.406: 56.77,69.85 v56.64,69.98 56.64,68.2 58.04,66.8 58.04,62.93 58.67,62.29 58.67,57.28 DSP4.9 | DSP3.10 101.93,101.73 93.22,101.73 91.26,99.77 DSP3.15 91.19,99.69 88.14,96.65 72.14,96.65 v66.29,90.81 DSP2.10 64.34,101.73 55.5,101.73 53.59,99.82 DSP2.15 53.52,99.77 51.56,101.73 30.66,101.73 DSP1.10
DSPA_SEG_C  (via drill 0.38)
  Top 0.406: 55.18,73.03 U2.20 55.18,70.36 v55.56,69.98 | 55.18,73.03 51.05,77.15 DSP2.3 | DSP1.8 26.16,77.72 24.26,75.82 22.99,75.82 22.35,76.45 22.35,78.87 21.46,79.76 15.44,79.76 DSP1.3 | 55.18,73.03 55.18,73.09 57.91,75.82 58.8,75.82 59.94,76.96 v59.94,77.09
  Bottom 0.406: v55.56,69.98 55.82,69.72 55.82,55.05 DSP4.7 | DSP3.8 99.39,75.82 90.55,75.82 88.65,77.72 DSP3.3 85.8,74.93 78.36,74.93 73.79,79.5 65.48,79.5 DSP2.8 61.9,79.63 60.71,79.63 59.94,78.87 v59.94,77.09 | DSP1.8 28.65,80.26 48.31,80.26 48.56,80.26 DSP2.3
DSPA_SEG_D  (via drill 0.38)
  Top 0.406: v53.28,72.71 U2.23 v53.28,72.71 | v53.28,72.71 52.32,73.66 48.51,77.47 DSP2.2 50.37,79.63 56.83,79.63 58.67,77.79 DSP2.6 | DSP3.6 96.27,77.72 94.36,75.82 88.06,75.82 DSP3.2 | DSP1.2 10.92,77.72 12.57,76.07 19.38,76.07 DSP1.6
  Bottom 0.406: v53.28,72.71 53.28,61.91 52.32,60.96 51.37,60.96 49.78,59.37 49.78,50.93 DSP4.5 | DSP3.2 84.15,75.82 79.12,75.82 74.61,80.33 72.96,80.33 71.06,80.33 61.28,80.33 61.23,80.33 59.88,80.33 58.67,79.12 DSP2.6 | DSP1.6 22.91,75.95 35.31,75.95 38.86,79.5 46.48,79.5 46.79,79.5 DSP2.2
DSPA_SEG_DP  (via drill 0.38)
  Top 0.254: LED18.A v52.07,28.89 | LED17.A v52.07,30.8 | v52.07,32.7 LED16.A 54.2,31.75 57.28,31.75 58.67,33.15 72.9,33.15 v73.34,32.7 74.17,32.7 74.55,32.7 LED20.A | v52.07,34.61 LED15.A v53.24,40.23 | v40.64,46.35 40.64,43.5 42.61,41.53 52.7,41.53 53.08,41.53 v53.24,41.69 | v45.09,68.26 v46.99,70.17 | U2.22 53.91,70.36 53.66,70.1 52.39,70.1 v49.66,72.83 | LED21.A v73.34,28.89 | LED22.A v73.34,30.8 | LED19.A 73.72,34.61 v73.53,34.42
  Bottom 0.254: v52.07,28.89 v52.07,30.8 v52.07,32.7 v52.07,34.61 | v53.24,40.23 v53.24,41.69 | v40.64,46.35 40.64,63.82 v45.09,68.26 | v46.99,70.17 v49.66,72.83 | v73.34,28.89 v73.34,30.8 73.34,31.81 v73.34,32.7 73.53,32.89 v73.53,34.42
DSPA_SEG_E  (via drill 0.38)
  Top 0.406: v54.55,69.98 U2.21 54.55,72.71 54.55,72.83 52.2,75.18 v51.94,75.18 | v45.72,71.5 22.35,71.5 v18.54,75.31
  Bottom 0.406: v54.55,69.98 54.55,61.47 53.4,60.33 51.69,60.33 50.42,59.05 50.42,52.83 DSP4.4 | DSP3.5 92.13,79.38 85.17,79.38 DSP3.1 80.25,81.09 59.45,81.09 DSP2.5 54.04,75.69 53.53,75.18 v51.94,75.18 48.56,75.18 DSP2.1 45.97,71.75 v45.72,71.5 | DSP1.1 8.38,77.6 10.16,75.82 16.59,75.82 DSP1.5 18.54,77.52 v18.54,75.31
DSPA_SEG_F  (via drill 0.38)
  Top 0.254: 45.97,99.69 DSP2.18
  Top 0.406: v42.8,90.81 42.8,78.55 51.82,69.53 53.28,69.53 53.59,69.22 56.96,69.22 57.66,69.91 v57.66,69.98 57.72,70.04 U2.16 | v59.94,60.64 61.21,59.37 61.21,52.7 60.58,52.07 51.18,52.07 50.42,52.83 50.42,54.29 50.42,55.24 51.05,55.88 DSP4.2 | DSP1.12 26.24,97.16 34.54,97.16 36.07,97.16 42.16,97.16 42.8,96.52 | v42.8,93.34 42.8,96.52 | 42.8,96.52 45.97,99.69 48.01,101.73 59.26,101.73 61.63,99.35 | DSP3.18 80.95,97.16 80.9,97.16 64.26,97.16 63.83,97.16 61.63,99.35 | 61.63,99.35 DSP2.12
  Bottom 0.406: v42.8,90.81 v42.8,93.34 | 57.72,68.58 58.07,68.23 | 58.07,68.23 61.21,65.09 61.21,61.91 v59.94,60.64 | v57.66,69.98 57.66,68.64 58.07,68.23 | DSP3.12 98.81,99.69 100.46,98.04 104.27,98.04 105.16,98.93 105.16,101.35 104.14,102.36 86.16,102.36 DSP3.18 | DSP1.18 8.38,99.82 10.29,101.73 21.67,101.73 DSP1.12
DSPA_SEG_G  (via drill 0.38)
  Top 0.406: 34.54,91.76 33.91,92.39 33.27,92.39 25.97,92.39 18.3,92.39 DSP1.17 | 34.54,91.76 35.18,92.39 44.39,92.39 51.11,92.39 52.09,93.37 | 61.21,91.76 DSP2.7 61.21,75.88 v58.99,73.66 | 61.21,91.76 60.58,92.39 53.28,92.39 53.07,92.39 52.09,93.37 | 61.21,91.76 61.85,92.39 71.06,92.39 73.47,92.39 v79.31,92.39 79.31,93.53 85.55,99.77 DSP3.17 | v58.99,73.66 58.36,73.03 | 58.36,73.03 57.09,73.03 | 57.09,73.03 56.45,72.39 | 56.45,72.39 U2.18 56.45,72.39 | 56.45,72.39 57.09,73.03 | 57.09,73.03 58.36,73.03 | 58.36,73.03 v58.99,73.66 | v62.48,59.37 62.48,48.58 62.48,46.99 51.05,46.99 49.78,48.26 49.78,57.78 50.42,58.42 DSP4.1 | DSP3.7 98.81,80.52 v86.93,92.39 | DSP1.7 23.67,77.78 34.54,88.65 34.54,91.76 | DSP2.17 48.51,99.76 52.07,96.2 52.07,93.4 52.09,93.37
  Bottom 0.406: v86.93,92.39 v79.31,92.39 | v58.99,73.66 60.26,72.39 60.26,68.26 62.48,66.04 62.48,61.28 v62.48,59.37
DSPB_SEG_A  (via drill 0.38)
  Top 0.254: DSP5.7 21.7,38.59 v22.16,39.05 | DSP6.7 28.69,38.59 v29.15,39.05 | DSP7.7 43.29,38.59 v43.75,39.05 | DSP8.7 50.28,38.34 v50.99,39.05 | DSP9.7 64.88,38.34 v65.6,39.05 | DSP10.7 71.87,38.59 v72.33,39.05 | DSP11.7 86.47,38.34 86.47,38.49 v85.92,39.05 | DSP12.7 93.46,38.56 v92.96,39.05 | v86.3,53.98 85.34,54.93 84.39,55.88 U1.15
  Bottom 0.254: v29.15,39.05 30.1,39.05 | 30.1,39.05 v43.75,39.05 | v43.75,39.05 44.39,39.05 | 44.39,39.05 v50.99,39.05 | v50.99,39.05 51.69,39.05 | 51.69,39.05 v65.6,39.05 | v65.6,39.05 66.61,39.05 | 66.61,39.05 v72.33,39.05 | v72.33,39.05 73.28,39.05 | 73.28,39.05 v85.92,39.05 | v29.15,39.05 30.1,39.05 | v43.75,39.05 44.39,39.05 | v50.99,39.05 51.69,39.05 | v65.6,39.05 66.61,39.05 | v72.33,39.05 73.28,39.05 | v22.16,39.05 v29.15,39.05 | v85.92,39.05 85.66,39.05 | v86.3,53.98 86.3,50.55 86.36,50.48 92.96,43.88 v92.96,39.05 92.33,38.42 87.88,38.42 86.55,38.42 v85.92,39.05
DSPB_SEG_B  (via drill 0.38)
  Top 0.254: DSP5.6 23.14,34.9 v23.43,34.61 | DSP7.6 44.73,35.02 v45.15,34.61 | DSP9.6 66.32,34.9 v66.61,34.61 | DSP10.6 73.31,35.34 v72.39,34.42 | v88.2,34.61 87.91,34.9 DSP11.6 87.91,39.34 v87.25,40.01 | DSP12.6 94.9,35.27 v94.23,34.61 | U1.17 83.12,54.99 v84.14,53.98 | DSP6.6 30.13,35.59 v29.15,34.61 | DSP8.6 51.72,35.27 v51.05,34.61
  Bottom 0.254: v23.43,34.61 v29.15,34.61 29.15,35.5 30.48,36.83 42.93,36.83 v45.15,34.61 45.21,34.61 45.78,35.18 50.48,35.18 v51.05,34.61 51.75,35.31 65.91,35.31 v66.61,34.61 67.25,35.24 71.56,35.24 v72.39,34.42 72.39,35.37 74.42,37.4 85.41,37.4 v88.2,34.61 88.52,34.61 v94.23,34.61 | v87.25,40.01 87.25,47.05 84.14,50.16 v84.14,53.98
DSPB_SEG_C  (via drill 0.38)
  Top 0.254: DSP5.4 v21.7,24.59 | DSP6.4 28.69,25.05 v29.15,24.59 | DSP7.4 43.29,25.05 v43.75,24.59 | DSP8.4 50.28,25.05 v50.74,24.59 | DSP9.4 64.88,25.05 v65.34,24.59 | DSP10.4 71.87,25.05 v72.33,24.59 | DSP11.4 86.47,25.05 v86.93,24.59 | DSP12.4 93.46,24.94 v93.11,24.59 | U1.20 81.22,55.18 v80.52,54.48 | v84.33,30.48 v86.42,30.48 | v80.07,34.42 v80.07,39.88
  Bottom 0.254: v21.7,24.59 v29.15,24.59 | v29.15,24.59 29.78,24.59 | 29.78,24.59 v43.75,24.59 | v43.75,24.59 44.39,24.59 | 44.39,24.59 v50.74,24.59 | v50.74,24.59 51.37,24.59 | 51.37,24.59 v65.34,24.59 | v65.34,24.59 65.98,24.59 | 65.98,24.59 v72.33,24.59 | v72.33,24.59 72.96,24.59 | 72.96,24.59 v86.93,24.59 | v86.93,24.59 87.57,24.59 | 87.57,24.59 89.47,24.59 92.65,24.59 | 92.65,24.59 v93.11,24.59 92.65,24.59 | v29.15,24.59 29.78,24.59 | v43.75,24.59 44.39,24.59 | v50.74,24.59 51.37,24.59 | v65.34,24.59 65.98,24.59 | v72.33,24.59 72.96,24.59 | v86.93,24.59 87.57,24.59 | v80.52,54.48 80.52,51.82 80.33,51.63 80.33,40.13 v80.07,39.88 | v86.42,30.48 86.42,25.1 v86.93,24.59 | v84.33,30.48 84.01,30.48 v80.07,34.42
DSPB_SEG_D  (via drill 0.38)
  Top 0.254: DSP5.2 18.82,24.29 19.62,23.5 | DSP6.2 25.81,24.29 26.61,23.5 | DSP7.2 40.41,24.29 41.21,23.5 | DSP8.2 47.4,24.29 48.2,23.5 | DSP9.2 62,24.29 62.8,23.5 | DSP10.2 68.99,24.29 69.79,23.5 | 84.39,23.5 83.59,24.29 DSP11.2 v83.59,28.8 | DSP12.2 90.58,24.29 89.79,23.5 89.47,23.5 | 89.47,23.5 84.39,23.5 | 84.39,23.5 69.79,23.5 | 69.79,23.5 62.8,23.5 | 62.8,23.5 48.2,23.5 | 48.2,23.5 41.21,23.5 | 41.21,23.5 26.61,23.5 | 26.61,23.5 19.62,23.5 | 19.62,23.5 26.61,23.5 | 41.21,23.5 48.2,23.5 | 62.8,23.5 69.79,23.5 | 84.39,23.5 89.47,23.5 | U1.23 79.31,55.82 v77.98,54.48 | v78.17,34.42 v78.17,39.88
  Bottom 0.254: v77.98,54.48 77.98,52.58 79.38,51.18 79.38,50.55 79.38,41.08 v78.17,39.88 | v83.59,28.8 83.59,28.99 v78.17,34.42
DSPB_SEG_DP  (via drill 0.38)
  Top 0.254: LED11.C LED12.C LED13.C LED14.C v98.52,49.88 | LED10.C 34.67,28.89 v34.92,29.15 | v34.92,31.43 34.29,30.8 LED9.C LED8.C | LED7.C 33.97,34.61 v34.92,35.56 v34.92,40.01 | U1.22 79.95,57.72 v80.33,58.1 | v44.7,44.07 46.04,45.4 64.96,45.4 v66.29,46.74
  Bottom 0.254: v34.92,29.15 v34.92,31.43 | v34.92,31.43 34.92,32.07 | 34.92,32.07 v34.92,35.56 | v34.92,31.43 34.92,32.07 | v34.92,40.01 34.92,42.86 36.13,44.07 v44.7,44.07 | v98.52,49.88 98.52,54.51 94.93,58.1 v80.33,58.1 77.15,58.1 75.56,56.52 75.56,47.62 74.68,46.74 v66.29,46.74
DSPB_SEG_E  (via drill 0.38)
  Top 0.254: DSP5.1 17.38,28.56 18.35,29.53 25.34,29.53 | DSP6.1 24.37,28.56 25.34,29.53 | DSP7.1 38.97,28.56 40.26,29.84 | DSP8.1 45.96,28.56 47.24,29.84 | DSP9.1 60.56,28.56 61.85,29.84 | DSP10.1 67.55,28.56 68.83,29.84 | DSP11.1 82.15,28.56 83.44,29.84 | DSP12.1 89.14,28.59 88.2,29.53 v84.33,29.53 83.82,29.53 83.76,29.53 83.44,29.84 | 83.44,29.84 68.83,29.84 | 61.85,29.84 47.24,29.84 | 40.26,29.84 47.24,29.84 | 61.85,29.84 68.83,29.84 | U1.21 80.58,55.82 v79.25,54.48 | v79.12,39.88 v79.12,34.42 | 25.34,29.53 25.65,29.84 40.26,29.84
  Bottom 0.254: v79.25,54.48 79.25,52.07 79.88,51.44 79.88,40.64 v79.12,39.88 | v84.33,29.53 84.01,29.53 v79.12,34.42
DSPB_SEG_F  (via drill 0.38)
  Top 0.254: DSP5.9 18.82,40.16 19.62,40.96 | DSP6.9 25.81,40.16 26.61,40.96 | DSP7.9 40.41,40.16 41.21,40.96 | DSP8.9 47.4,40.16 48.2,40.96 | DSP9.9 62,40.16 62.8,40.96 | DSP10.9 68.99,40.16 69.79,40.96 | DSP11.9 83.59,40.16 84.39,40.96 | v88.08,40.96 87.88,40.96 | 87.88,40.96 v88.08,40.96 | v88.08,40.96 84.39,40.96 | 84.39,40.96 78.49,40.96 v78.17,40.96 | 70.42,40.96 69.79,40.96 | 69.79,40.96 62.8,40.96 | 62.8,40.96 48.2,40.96 | 48.2,40.96 41.21,40.96 | 41.21,40.96 26.61,40.96 | 26.61,40.96 19.62,40.96 | 19.62,40.96 26.61,40.96 | 41.21,40.96 48.2,40.96 | 62.8,40.96 69.79,40.96 | 69.79,40.96 70.42,40.96 | 69.79,40.96 70.42,40.96 | 84.39,40.96 v88.08,40.96 | v88.08,40.96 87.88,40.96 | U1.16 83.76,55.44 v85.22,53.98 | DSP12.9 90.58,38.45 v88.08,40.96 | 70.42,40.96 73.34,40.96 v73.66,40.96
  Bottom 0.254: v78.17,40.96 v73.66,40.96 | v88.08,40.96 88.08,47.5 85.41,50.16 85.22,50.35 v85.22,53.98
DSPB_SEG_G  (via drill 0.38)
  Top 0.254: DSP5.10 17.38,34.62 18.35,33.66 25.34,33.66 | DSP6.10 24.37,34.62 25.34,33.66 | DSP7.10 38.97,34.62 39.94,33.66 | DSP8.10 45.96,34.62 46.93,33.66 | DSP9.10 60.56,34.62 61.53,33.66 | DSP10.10 67.55,34.62 68.52,33.66 | DSP11.10 82.15,34.62 82.8,33.97 83.12,33.66 | 25.34,33.66 39.94,33.66 | 68.52,33.66 82.49,33.66 | 61.53,33.66 68.52,33.66 | 46.93,33.66 61.53,33.66 | 39.94,33.66 46.93,33.66 | 83.12,33.66 88.52,33.66 89.14,34.27 DSP12.10 89.14,38.62 v88.58,39.18 | 83.12,33.66 82.49,33.66 | U1.18 82.49,54.55 v83.06,53.98 | U1.11 85.03,48.01 v85.09,47.94 | 82.49,33.66 83.12,33.66
  Bottom 0.254: v88.58,39.18 86.81,39.18 85.79,40.2 85.79,47.24 v85.09,47.94 83.19,49.85 83.06,49.97 v83.06,53.98
GND  (via drill 0.38, 3.2 pad 5)
  other vias: 92.96,3.81 92.96,64.33 19.18,64.33 19.3,3.81 56.71,64.14 57.4,61.28 48.83,68.39 63.75,46.99 34.86,93.34 39.94,93.34 28.19,93.34 61.21,93.34 53.59,93.34 77.03,93.6 57.4,93.34 48.83,64.14 56.13,53.34 56.13,50.8 22.48,56.45 22.48,53.91 22.48,51.37 22.48,58.99 59.44,38.35 57.72,27.3 74.68,27.43 36.77,38.04 36.58,25.53 36.77,40.01 59.94,40.01 62.04,34.42 68.01,41.91 68.26,39.94 72.33,40.01 45.78,40.01 24.19,40.01 77.03,91.19 44.07,93.34 74.93,99.69 87.38,98.04 54.86,78.87 59.82,34.42 50.99,40.01 63.75,41.91 54.29,37.4 48.32,40.01 33.53,37.97 33.53,40.01 34.8,87.31 31.24,77.79 74.68,25.46 59.94,61.72 59.94,64.52 69.72,39.94 36.58,30.61 36.58,28
  pour Top: 0,106.36 112.52,106.36 112.52,0 0,0
  pour Bottom: 0,106.36 112.52,106.36 112.52,0 0,0
LED1_R
  Top 0.254: LED1.K R3.2
LED2_R
  Top 0.254: LED2.K R6.2
LED3_R
  Top 0.254: LED3.K 51.12,5.68 R4.2
LED4_R
  Top 0.254: LED4.K R5.2
LED5_R
  Top 0.254: R7.2 76.45,12.64 LED5.K
LED6_R
  Top 0.254: LED6.K R8.2
LED_COMM
  Top 0.406: LED5.A 73.91,12.7 70.74,15.88 9.14,15.88 5.02,20 5.02,48.2 6.92,50.1 CN1.1
LED_FAULT
  Top 0.406: LED4.A 34.54,13.97 8.19,13.97 3.11,19.05 3.11,53.91 6.92,57.72 CN1.7
LED_ISET
  Top 0.406: U2.13 60.96,72.61 61.85,73.49 R2.1
LED_ISET1
  Top 0.254: U1.13 86.04,56.66 R1.1
LED_OK
  Top 0.406: LED2.A 58.67,15.24 8.83,15.24 4.38,19.68 4.38,50.1 6.92,52.64 CN1.3
LED_WAIT
  Top 0.406: LED3.A 48.58,12.95 47.56,13.97 46.93,14.61 8.51,14.61 3.75,19.37 3.75,52.01 6.92,55.18 CN1.5
SCL  (via drill 0.38)
  Top 0.254: U2.14 58.99,70.42 v59.44,69.98 79.5,69.98 85.03,64.45 U1.14 | v47.88,69.22 47.88,62.87 37.72,52.7 35.12,50.1 CN1.2
  Bottom 0.254: v59.44,69.98 59.44,71.63 57.09,73.98 52.64,73.98 52.51,73.85 v47.88,69.22
SDA  (via drill 0.38)
  Top 0.254: CN1.4 25.65,51.69 25.34,51.37 25.34,49.47 26.29,48.51 34.23,48.51 36.53,50.82 46.67,60.96 v47.75,60.96 47.75,61.38 47.75,61.98 48.39,62.61 51.67,65.89 U2.1 | v78.55,49.28 78.55,50.23 78.61,50.29 78.68,50.35 U1.1
  Bottom 0.254: v78.55,49.28 75.31,46.04 50.99,46.04 50.67,46.35 47.75,49.28 v47.75,60.96

### Text on the board
tPlace: UTC | Hour | Minute | Second | +5V | GND | Fault | Wait | 1 PPS | OK | SDA | CC-BY-SA | Comm | SCL | HackLab.TO | Module | tick-ref-gps-disp | Status | Rev002 | SVN 1 | SVN 2 | SVN 3 | SVN 4 | Power | Fault | Wait | OK | Comms | 1 PPS
bPlace: http://hackstrich.sen.cx/HackLab.TO_Timing_Reference_A | designed by sen, 2014
Milling: UTC | Hour | Minute | Second | Status | SV 1 | SV 2 | SV 3 | SV 4 | Power | Fault | Wait | OK | Comms | 1 PPS